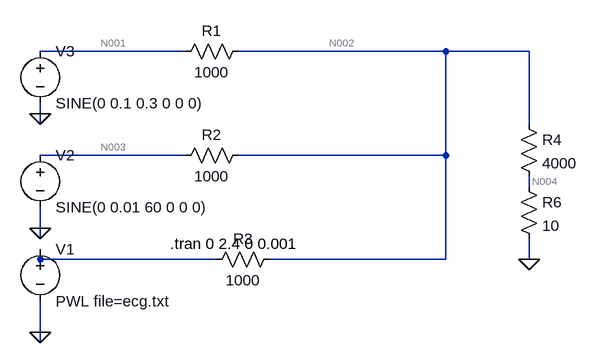
[diagram p0: schematic PS1 winter project.asc]
PS1 winter project.asc, the LTspice schematic file:
Version 4.1
SHEET 1 1304 680
WIRE 352 -192 128 -192
WIRE 752 -192 432 -192
WIRE 880 -192 752 -192
WIRE 128 -96 128 -112
WIRE 128 -80 128 -96
WIRE 880 -80 880 -192
WIRE 352 -32 128 -32
WIRE 752 -32 752 -192
WIRE 752 -32 432 -32
WIRE 880 16 880 0
WIRE 128 80 128 48
WIRE 128 96 128 80
WIRE 128 128 128 112
WIRE 400 128 128 128
WIRE 752 128 752 -32
WIRE 752 128 480 128
WIRE 880 128 880 96
WIRE 128 144 128 128
WIRE 128 240 128 192
WIRE 128 256 128 240
FLAG 128 240 0
FLAG 128 -96 0
FLAG 128 80 0
FLAG 880 128 0
SYMBOL voltage 128 96 R0
WINDOW 123 0 0 Left 0
WINDOW 39 0 0 Left 0
SYMATTR InstName V1
SYMATTR Value PWL file=ecg.txt
SYMBOL voltage 128 -48 R0
WINDOW 123 0 0 Left 0
WINDOW 39 0 0 Left 0
SYMATTR InstName V2
SYMATTR Value SINE(0 0.01 60 0 0 0)
SYMBOL voltage 128 -208 R0
WINDOW 123 0 0 Left 0
WINDOW 39 0 0 Left 0
SYMATTR InstName V3
SYMATTR Value SINE(0 0.1 0.3 0 0 0)
SYMBOL res 448 -208 R90
WINDOW 0 0 56 VBottom 2
WINDOW 3 32 56 VTop 2
SYMATTR InstName R1
SYMATTR Value 1000
SYMBOL res 448 -48 R90
WINDOW 0 0 56 VBottom 2
WINDOW 3 32 56 VTop 2
SYMATTR InstName R2
SYMATTR Value 1000
SYMBOL res 496 112 R90
WINDOW 0 0 56 VBottom 2
WINDOW 3 32 56 VTop 2
SYMATTR InstName R3
SYMATTR Value 1000
SYMBOL res 864 -96 R0
SYMATTR InstName R4
SYMATTR Value 4000
SYMBOL res 864 0 R0
SYMATTR InstName R6
SYMATTR Value 10
TEXT 328 104 Left 2 !.tran 0 2.4 0 0.001

The netlist it stands for:
* PS1 winter project.asc
V1 N005 0 PWL file=ecg.txt
V2 N003 0 SINE(0 0.01 60 0 0 0)
V3 N001 0 SINE(0 0.1 0.3 0 0 0)
R1 N002 N001 1000
R2 N002 N003 1000
R3 N002 N005 1000
R4 N002 N004 4000
R6 N004 0 10
.tran 0 2.4 0 0.001
.backanno
.end

* Results of the author's LTspice run, read from the files saved beside the schematic
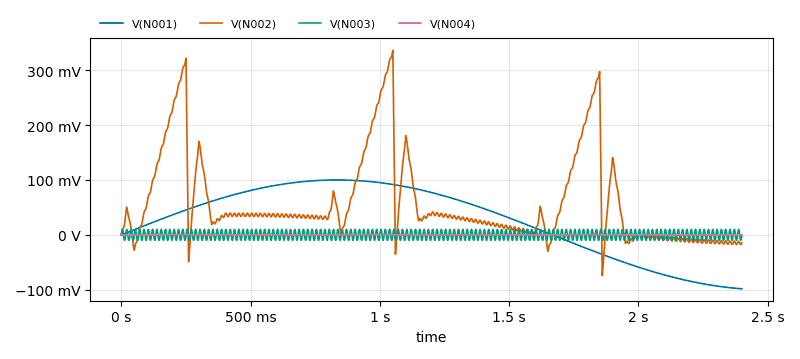
[diagram p1: Transient Analysis of PS1 winter project.asc, plotted from the saved traces]
* Transient Analysis, 1 run:
*   V(N001): min -98.23 mV, max 100 mV, average 26.25 mV, rms 69.26 mV, last -98.23 mV
*   V(N002): min -74.33 mV, max 336 mV, average 58.31 mV, rms 99.39 mV, last -14.84 mV
*   V(N003): min -10 mV, max 10 mV, average -17.26 nV, rms 7.115 mV, last 0 V
*   V(N004): min -185.4 µV, max 837.9 µV, average 145.4 µV, rms 247.9 µV, last -37.01 µV